# EAGLE design arduinoShield (EAGLE 9.2.2)
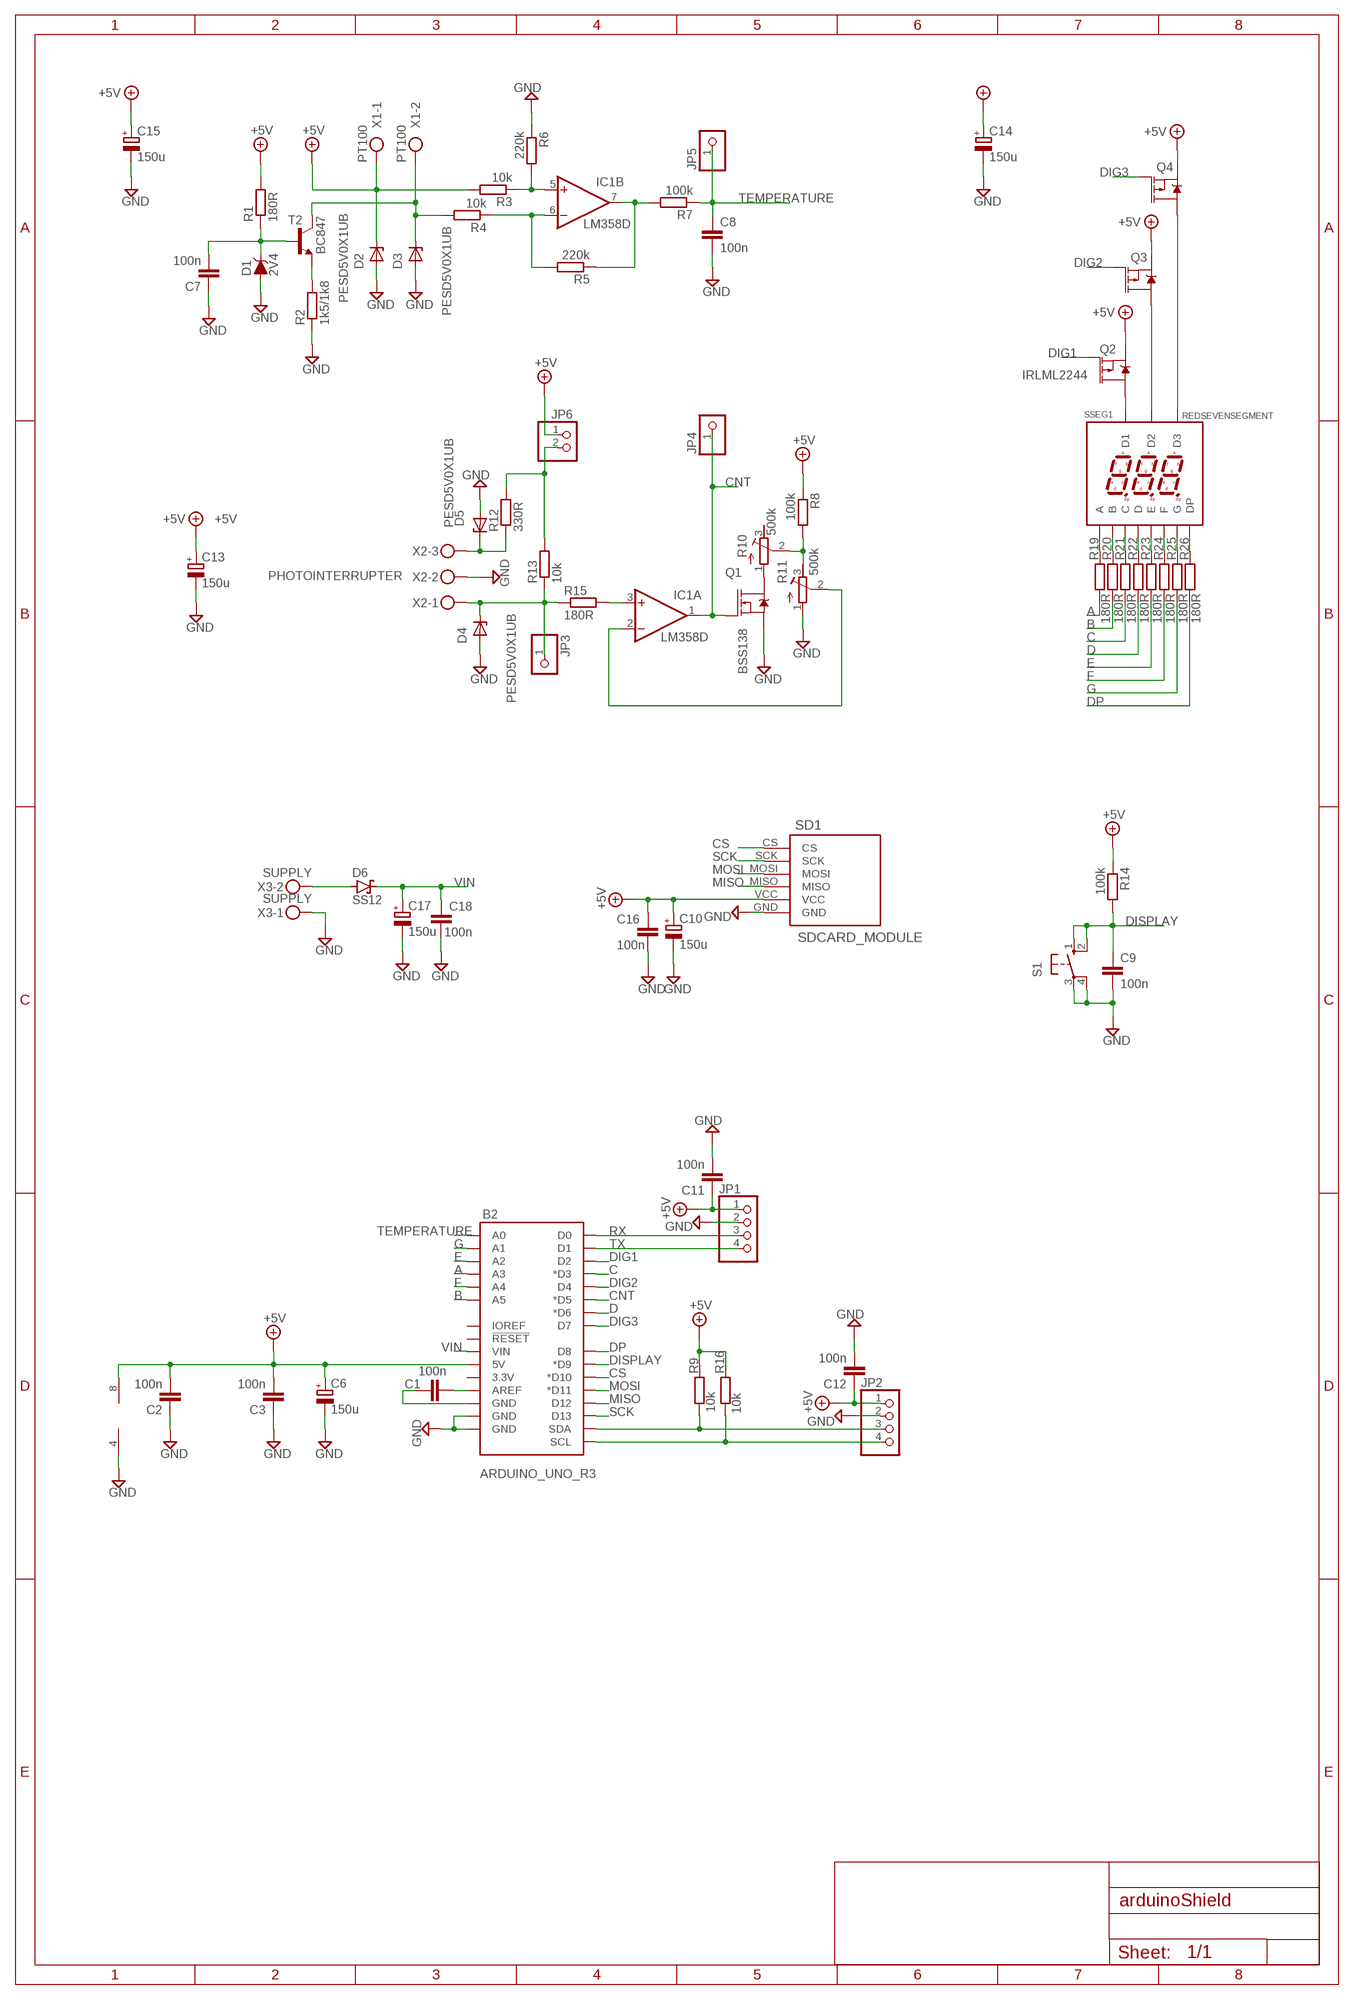
[diagram p0: schematic, sheet 1]

## Parts
B2  ARDUINO_UNO_R3  ARDUINO_UNO_R3_HOLES_NOISP  [ARDUINO_R3_NOISP]
C1  100n  C-EUC0805  [C0805]
C2  100n  C-EUC0805  [C0805]
C3  100n  C-EUC0805  [C0805]
C6  150u  CPOL-EUD/7343-31R  [D/7343-31R]
C7  100n  C-EUC0805  [C0805]
C8  100n  C-EUC0805  [C0805]
C9  100n  C-EUC0805  [C0805]
C10  150u  CPOL-EUD/7343-31R  [D/7343-31R]
C11  100n  C-EUC0805  [C0805]
C12  100n  C-EUC0805  [C0805]
C13  150u  CPOL-EUD/7343-31R  [D/7343-31R]
C14  150u  CPOL-EUD/7343-31R  [D/7343-31R]
C15  150u  CPOL-EUD/7343-31R  [D/7343-31R]
C16  100n  C-EUC0805  [C0805]
C17  150u  CPOL-EUD/7343-31R  [D/7343-31R]
C18  100n  C-EUC0805  [C0805]
D1  2V4  DIODE-ZENER-BZT52C3V6S  [SOD-323]
D2  PESD5V0X1UB  [SOD523]
D3  PESD5V0X1UB  [SOD523]
D4  PESD5V0X1UB  [SOD523]
D5  PESD5V0X1UB  [SOD523]
D6  SS12  [SMA]
IC1  LM358D  [SO08]
JP1  PINHD-1X4  [1X04]
JP2  PINHD-1X4  [1X04]
JP3  PINHD-1X1  [1X01]
JP4  PINHD-1X1  [1X01]
JP5  PINHD-1X1  [1X01]
JP6  PINHD-1X2  [1X02]
Q1  BSS138  MOSFET-NCH-BSS138  [SOT23-3]
Q2  IRLML2244  MOSFET_PCH-IRLML2244  [SOT23-3]
Q3  4.3A/20V/54mΩ  MOSFET_PCH-IRLML2244  [SOT23-3]
Q4  4.3A/20V/54mΩ  MOSFET_PCH-IRLML2244  [SOT23-3]
R1  180R  R-EU_R0805  [R0805]
R2  1k5/1k8  R-EU_R0805  [R0805]
R3  10k  R-EU_R0805  [R0805]
R4  10k  R-EU_R0805  [R0805]
R5  220k  R-EU_R0805  [R0805]
R6  220k  R-EU_R0805  [R0805]
R7  100k  R-EU_R0805  [R0805]
R8  100k  R-EU_R0805  [R0805]
R9  10k  R-EU_R0805  [R0805]
R10  500k  R-TRIMM64Y  [RTRIM64Y]
R11  500k  R-TRIMM64Y  [RTRIM64Y]
R12  330R  R-EU_R0805  [R0805]
R13  10k  R-EU_R0805  [R0805]
R14  100k  R-EU_R0805  [R0805]
R15  180R  R-EU_R0805  [R0805]
R16  10k  R-EU_R0805  [R0805]
R19  180R  R-EU_R0805  [R0805]
R20  180R  R-EU_R0805  [R0805]
R21  180R  R-EU_R0805  [R0805]
R22  180R  R-EU_R0805  [R0805]
R23  180R  R-EU_R0805  [R0805]
R24  180R  R-EU_R0805  [R0805]
R25  180R  R-EU_R0805  [R0805]
R26  180R  R-EU_R0805  [R0805]
S1  10-XX  [B3F-10XX]
SD1  SDCARD_MODULE  [SD_MODULE]
SSEG1  REDSEVENSEGMENT  [REDSEVENSEGMENT]
T2  BC847  BC847-NPN-SOT23-BEC  [SOT23-BEC]
X1  PT100  PCB2_TERMINAL-BLOCK  [2_2.54MM]
X2  PHOTOINTERRUPTER  MKDSN1,5/3-5,08  [MKDSN1,5/3-5,08]
X3  SUPPLY  MKDSN1,5/2-5,08  [MKDSN1,5/2-5,08]

## Nets
+5V: B2.5V C2.2 C3.2 C6.+ C10.+ C11.1 C12.1 C13.+ C14.+ C15.+ C16.1 D2.1(K) IC1.8(P:V+) JP1.1 JP2.1 JP6.1 Q2.2(S) Q3.2(S) Q4.2(S) R1.2 R3.2 R8.1 R9.2 R14.1 R16.2 SD1.VCC X1.1
A: B2.A3 R19.1
B: B2.A5 R20.1
C: B2.D3(*D3) R21.1
CNT: B2.D5(*D5) IC1.1(A:OUT) JP4.1 Q1.1(G)
CS: B2.D10(*D10) SD1.CS
D: B2.D6(*D6) R22.1
DIG1: B2.D2 Q2.1(G)
DIG2: B2.D4 Q3.1(G)
DIG3: B2.D7 Q4.1(G)
DISPLAY: B2.D9(*D9) C9.1 R14.2 S1.1(S) S1.2(S1)
DP: B2.D8 R26.1
E: B2.A2 R23.1
F: B2.A4 R24.1
G: B2.A1 R25.1
GND: B2.GND@1(GND) B2.GND@2(GND) C2.1 C3.1 C6.- C7.1 C8.2 C9.2 C10.- C11.2 C12.2 C13.- C14.- C15.- C16.2 C17.- C18.1 D1.A D2.2(A) D3.2(A) D4.2(A) D5.2(A) IC1.4(P:V-) JP1.2 JP2.2 Q1.2(S) R2.1 R6.1 R11.1(A) S1.3(P) S1.4(P1) SD1.GND X2.2 X3.1
MISO: B2.D12 SD1.MISO
MOSI: B2.D11(*D11) SD1.MOSI
N$1: B2.AREF C1.2
N$2: C7.2 D1.C R1.1 T2.B
N$3: R2.2 T2.E
N$4: D3.1(K) R4.2 T2.C X1.2
N$5: IC1.5(B:+IN) R3.1 R6.2
N$6: IC1.6(B:-IN) R4.1 R5.2
N$7: IC1.7(B:OUT) R5.1 R7.2
N$8: D5.1(K) R12.1 X2.3
N$9: B2.SDA JP2.3 R9.1
N$10: Q1.3(D) R10.1(A)
N$11: R8.2 R10.2(S) R11.3(E)
N$12: IC1.2(A:-IN) R11.2(S)
N$13: D4.1(K) JP3.1 R13.1 R15.1 X2.1
N$14: B2.SCL JP2.4 R16.1
N$15: JP6.2 R12.2 R13.2
N$16: B2.GND@3(GND) C1.1
N$18: Q2.3(D) SSEG1.2(D1)
N$19: Q3.3(D) SSEG1.4(D2)
N$20: Q4.3(D) SSEG1.5(D3)
N$21: D6.A X3.2
N$24: R19.2 SSEG1.9(A)
N$25: R20.2 SSEG1.7(B)
N$26: R21.2 SSEG1.1(C)
N$27: R22.2 SSEG1.3(D)
N$28: R23.2 SSEG1.10(E)
N$29: R24.2 SSEG1.8(F)
N$30: R25.2 SSEG1.11(G)
N$31: R26.2 SSEG1.6(DP)
N$32: IC1.3(A:+IN) R15.2
RX: B2.D0 JP1.3
SCK: B2.D13 SD1.SCK
TEMPERATURE: B2.A0 C8.1 JP5.1 R7.1
TX: B2.D1 JP1.4
VIN: B2.VIN C17.+ C18.2 D6.C
Unconnected: B2.3.3V B2.IOREF B2.RESET@1(!RESET!) R10.3(E)

## Library data of the parts
B2 = SparkFun-Boards_edit:ARDUINO_UNO_R3_HOLES_NOISP
C1-C3 C7-C9 C11 C12 C16 C18 = rcl:C-EU: CAPACITOR, European symbol; SPICEPREFIX: C
C6 C10 C13-C15 C17 = rcl:CPOL-EU: POLARIZED CAPACITOR, European symbol; SPICEPREFIX: C
D1 = SparkFun-DiscreteSemi:DIODE-ZENER: Zener Diode A Zener diode allows current to flow from its anode to its cathode like a normal semiconductor diode, but it also permits current to flow in the reverse direction when its "Zener voltage" is reached. - WIkipedia; PROD_ID: DIO-08199; VALUE: 3.6V
D2-D5 = nxp_60:PESD5V0X1UB: Ultra low capacitance unidirectional ElectroStatic Discharge (ESD) protection diode in a SOD523 (SC-79) ultra small and flat lead Surface-Mounted Device (SMD) plastic package designed to protect one signal line from the damage caused by ESD and other transients. AAL Eindhoven MK
D6 = Diodes:SS12: DIODE SCHOTTKY 20V 1A SMA Manufacturer's datasheet <https://www.onsemi.com/pub/Collateral/SS19-D.PDF>; CREATED_BY: PCBLayout.com; DIGIKEY_PART_NUMBER: SS12FSCT-ND; MANUFACTURER: ON Semiconductor; MPN: SS12; PACKAGE: SMA (DO-214AC)
IC1 = linear:LM358: OP AMP also LM158; LM258; LM2904 Source: http://cache.national.com/ds/LM/LM158.pdf
JP1 JP2 = pinhead:PINHD-1X4: PIN HEADER
JP3-JP5 = pinhead:PINHD-1X1: PIN HEADER
JP6 = pinhead:PINHD-1X2: PIN HEADER
Q1 = SparkFun-DiscreteSemi:MOSFET-NCH: N-channel MOSFETs Voltage controlled devices that allow control of high current outputs. SparkFun Products: SparkFun OpenScale <https://www.sparkfun.com/products/13261> SparkFun Digital Sandbox <https://www.sparkfun.com/products/12651> SparkFun Monster Moto Shield <https://www.sparkfun.com/products/10182> SparkFun MOSFET Power Controller <https://www.sparkfun.com/products/11214>; PROD_ID: TRANS-00830; VALUE: 220mA/50V/3.5Ω
Q2 = SparkFun-DiscreteSemi:MOSFET_PCH: P-channel MOSFETs Voltage controlled devices that allow control of high current outputs. SparkFun Products: SparkFun ESP32 Thing <https://www.sparkfun.com/products/13907> SparkFun ESP8266 Thing <https://www.sparkfun.com/products/13231>; PROD_ID: TRANS-11153; VALUE: 4.3A/20V/54mΩ
Q3 Q4 = SparkFun-DiscreteSemi:MOSFET_PCH: P-channel MOSFETs Voltage controlled devices that allow control of high current outputs. SparkFun Products: SparkFun ESP32 Thing <https://www.sparkfun.com/products/13907> SparkFun ESP8266 Thing <https://www.sparkfun.com/products/13231>; PROD_ID: TRANS-11153
R1-R9 R12-R16 R19-R26 = rcl:R-EU_: RESISTOR, European symbol; SPICEPREFIX: R
R10 R11 = rcl:R-TRIMM: Trimm resistor; SPICEMODEL: X; SPICEPREFIXL: POT
S1 = DC_LOAD_AU:10-XX: OMRON SWITCH; MPN: B3F-1000; OC_FARNELL: 176432; OC_NEWARK: 36M3542
SD1 = flightcontroller:SDCARD_MODULE: sd card module
SSEG1 = Neuhold_ssegment:REDSEVENSEGMENT: red 3 digit seven segment from neuhold electronic
T2 = DC_LOAD_AU:*-NPN-: NPN Transistror BF959 corrected 2008.03.06
X1 = nxs_con-misc:PCB2_TERMINAL-BLOCK: 2 way PCB terminal block 2.54mm RS Best.-Nr.: 790-1098
X2 = con-phoenix-508:MKDSN1,5/3-5,08: MKDSN 1,5/ 3-5,08 Printklemme Nennstrom: 13,5 A Nennspannung: 250 V Rastermaß: 5,08 mm Polzahl: 3 Anschlussart: Schraubanschluss Montage: Löten Anschlussrichtung Leiter/Platine: 0 ° Artikelnummer: 1729131 Source: http://eshop.phoenixcontact.com .. 1729131.pdf
X3 = con-phoenix-508:MKDSN1,5/2-5,08: MKDSN 1,5/ 2-5,08 Printklemme Nennstrom: 13,5 A Nennspannung: 250 V Rastermaß: 5,08 mm Polzahl: 2 Anschlussart: Schraubanschluss Montage: Löten Anschlussrichtung Leiter/Platine: 0 ° Artikelnummer: 1729128 Source: http://eshop.phoenixcontact.com .. 1729128.pdf

## Board
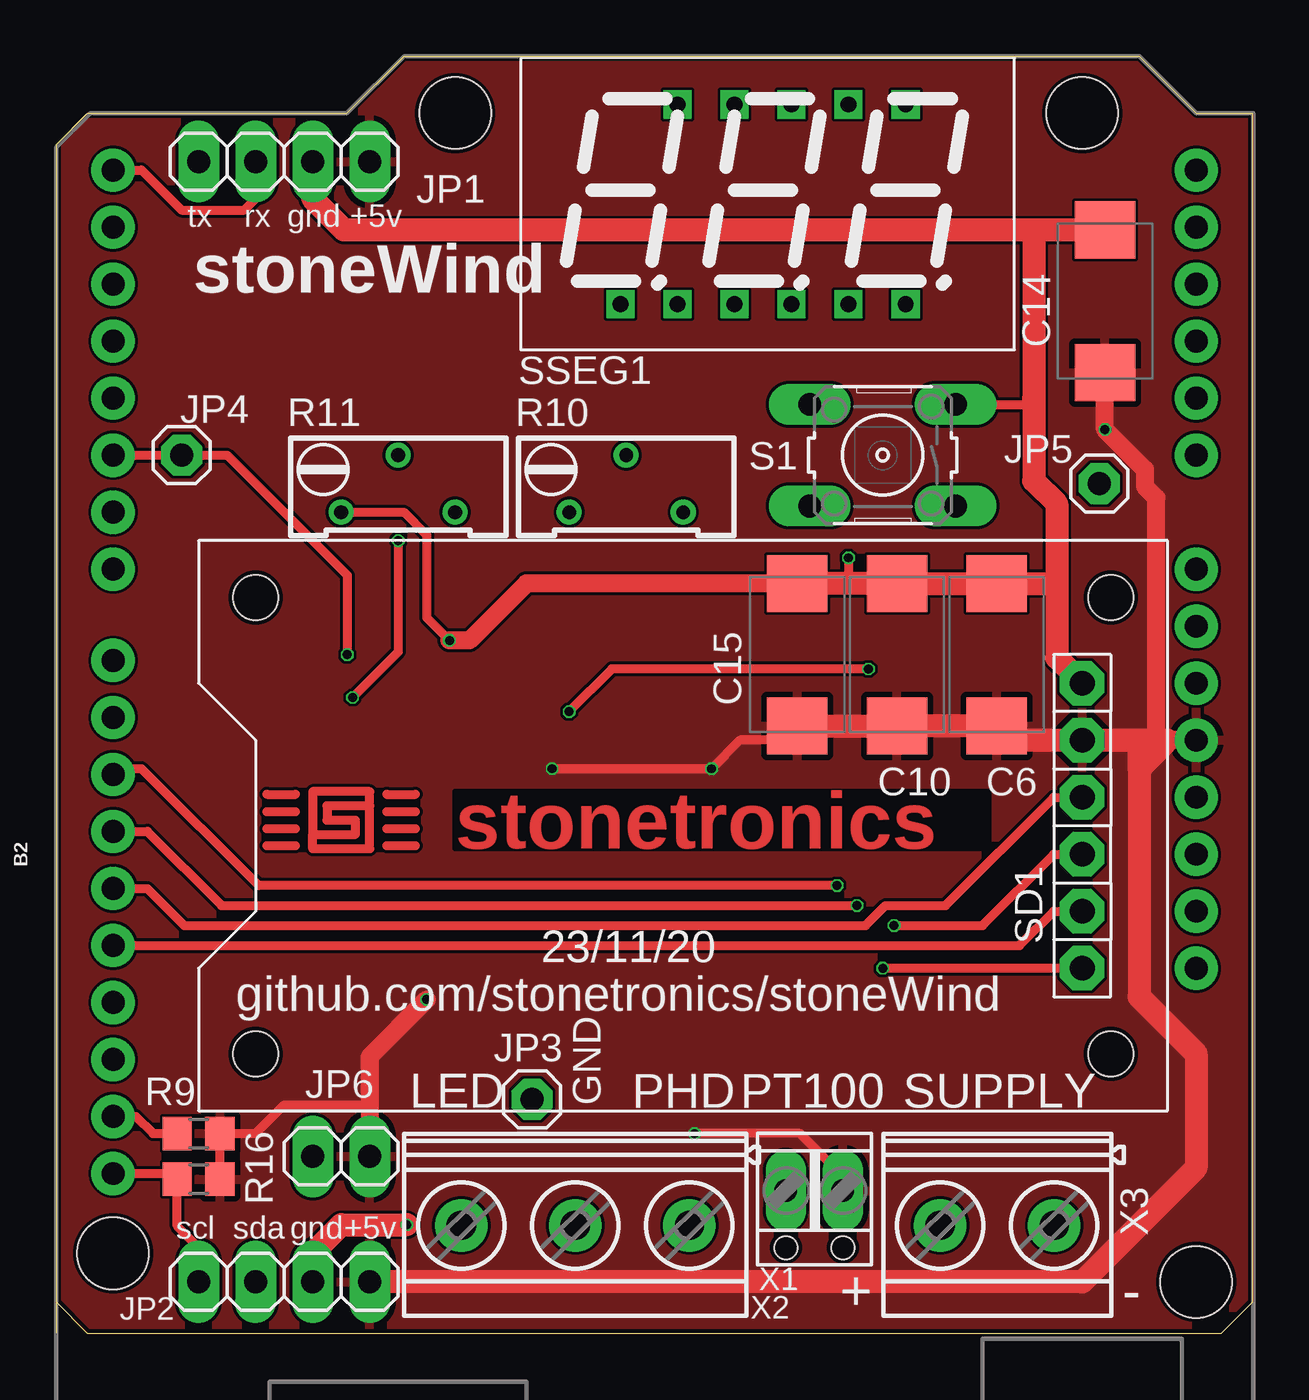
[diagram p1: board, top side]
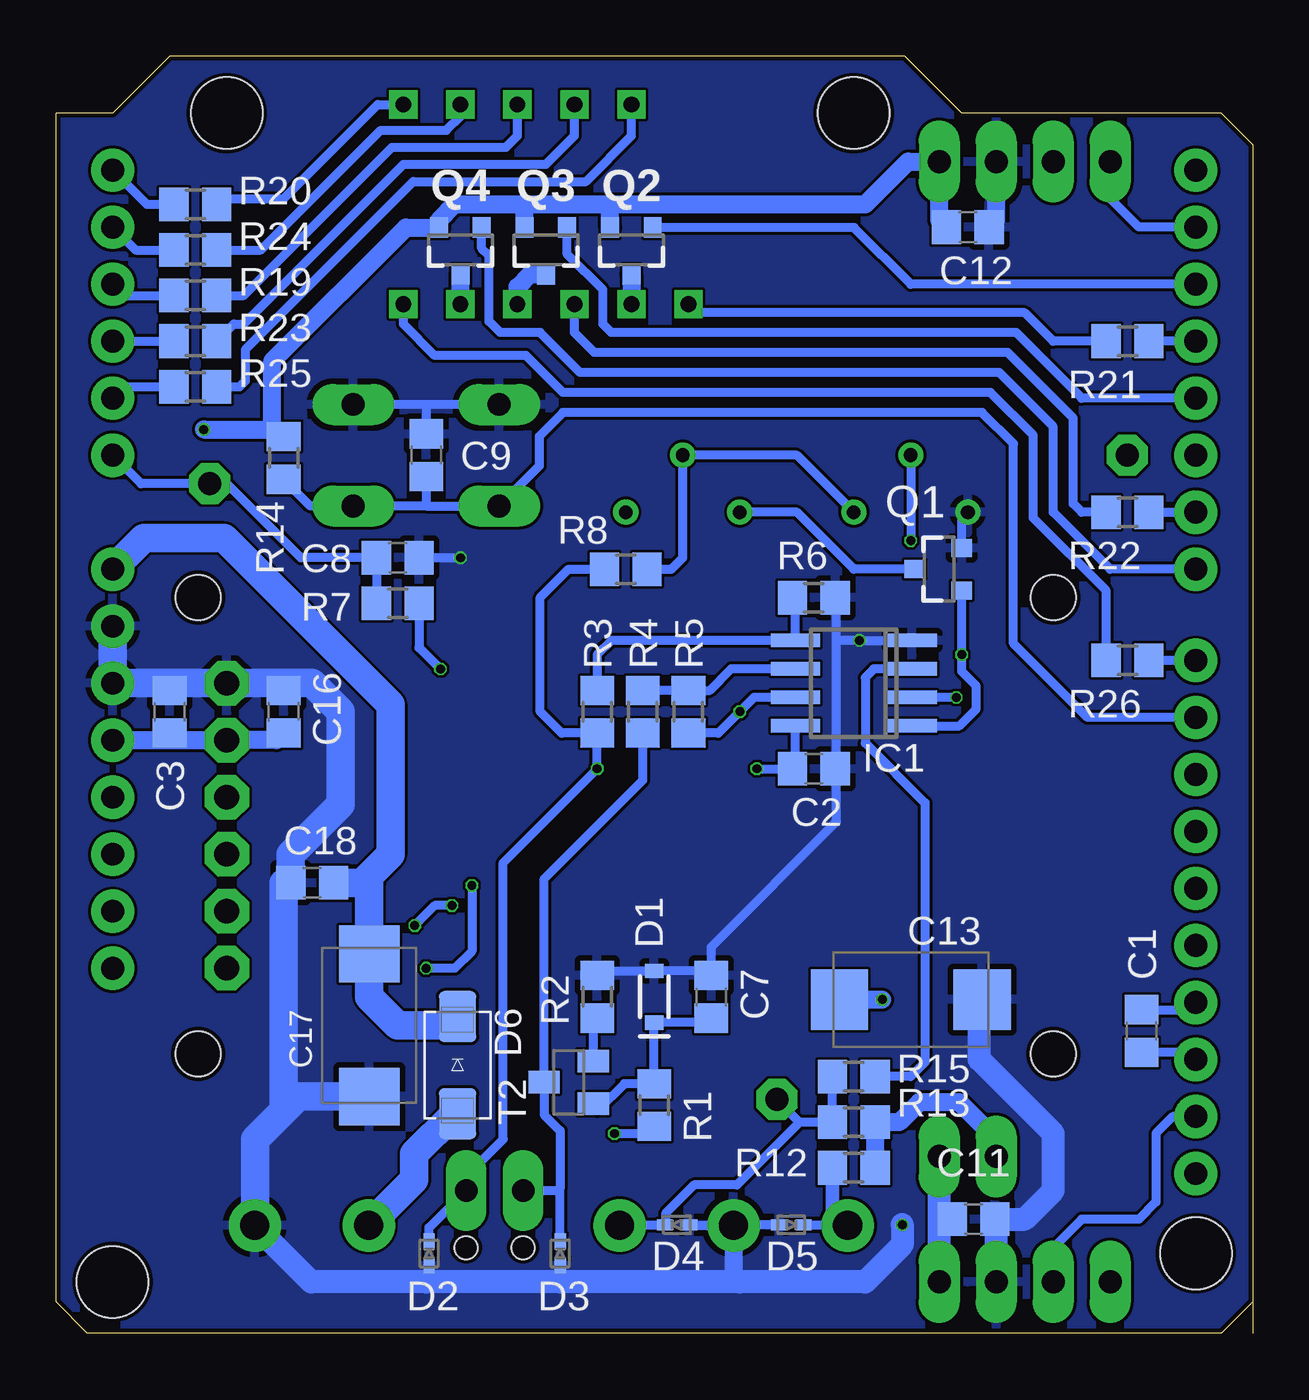
[diagram p2: board, bottom side, seen from below]

Size 53.32 x 56.9 mm. Coordinates in mm from the lower left corner, seen from the top.
Outline: 0,1.4 0,52.96 1.4,54.36 12.95,54.36 15.49,56.9 48.26,56.9 50.8,54.36 53.32,54.36 53.32,1.4 51.92,0 1.4,0 0,1.4
Outline: 0,1.4 0,0
Copper layers (1*16): Top 0.035mm / dielectric 1.6mm / Bottom 0.035mm
Design rules "jlcpcb-2layers": minimum track width 5mil, minimum drill 0.3mm, track to track 5mil, track to pad 5mil, pad to pad 5mil, via to via 5mil, smd to smd 5mil, copper to edge 0.2mm, drill to drill 6mil, minimum pad ring 10mil, minimum via ring 3mil, stop-mask expansion 4mil, vias tented up to drill 0mil, thermal gap 10mil

### Footprints (pad centres in the part's own frame; a part is rotated, then mirrored left to right if it is on the bottom)
ARDUINO_R3_NOISP = drill 1.016 pad 1.93: 3.3V 2.54,-24.13; 5V 5.08,-24.13; A0 17.78,-24.13; A1 20.32,-24.13; A2 22.86,-24.13; A3 25.4,-24.13; A4 27.94,-24.13; A5 30.48,-24.13; AREF -9.144,24.13; D0 30.48,24.13; D1 27.94,24.13; D2 25.4,24.13; D3 22.86,24.13; D4 20.32,24.13; D5 17.78,24.13; D6 15.24,24.13; D7 12.7,24.13; D8 8.636,24.13; D9 6.096,24.13; D10 3.556,24.13; D11 1.016,24.13; D12 -1.524,24.13; D13 -4.064,24.13; GND@1 7.62,-24.13; GND@2 10.16,-24.13; GND@3 -6.604,24.13; IOREF -2.54,-24.13; NC -5.08,-24.13; RESET@1 0,-24.13; SCL -14.224,24.13; SDA -11.684,24.13; VIN 12.7,-24.13 | hole 3.175: -17.78,24.13; 33.02,8.89; 33.02,-19.05; -19.05,-24.13
C0805 = smd 1.3 x 1.5: 1 -0.95,0; 2 0.95,0
D/7343-31R = smd 2.55 x 2.7: + 3.175,0; - -3.175,0
SOD-323 = smd 0.63 x 0.83: A 1.15,0; C -1.15,0
SOD523 = smd 0.7 x 0.5: 1 0.55,0; 2 -0.55,0
SMA = smd 2.28 x 1.66: A 2.165,0; C -2.165,0
SO08 = smd 0.6 x 2.2: 1 -1.905,-2.6; 2 -0.635,-2.6; 3 0.635,-2.6; 4 1.905,-2.6; 5 1.905,2.6; 6 0.635,2.6; 7 -0.635,2.6; 8 -1.905,2.6
1X04 = drill 1.016 long: 1 -3.81,0; 2 -1.27,0; 3 1.27,0; 4 3.81,0
1X01 = drill 1.016 octagon: 1 0,0
1X02 = drill 1.016 long: 1 -1.27,0; 2 1.27,0
SOT23-3 = smd 0.8 x 0.9: 1 -0.95,-1; 2 0.95,-1; 3 0,1.1
R0805 = smd 1.3 x 1.5: 1 -0.95,0; 2 0.95,0
RTRIM64Y = drill 0.61: 1 0,-2.54; 2 -2.54,0; 3 0,2.54
B3F-10XX = drill 1.016 long: 1 -3.251,2.261; 2 3.251,2.261; 3 -3.251,-2.261; 4 3.251,-2.261
SD_MODULE = drill 1.1 octagon: CS 0,6.35; GND 0,-6.35; MISO 0,-1.27; MOSI 0,1.27; SCK 0,3.81; VCC 0,-3.81 | hole 2: -1.27,-10.16; -1.27,10.16; 36.83,10.16; 36.83,-10.16
REDSEVENSEGMENT = drill 0.7 square: 1 -6.35,-3.81; 2 -3.81,-3.81; 3 -1.27,-3.81; 4 1.27,-3.81; 5 3.81,-3.81; 6 6.35,-3.81; 7 6.35,5.08; 8 3.81,5.08; 9 1.27,5.08; 10 -1.27,5.08; 11 -3.81,5.08
SOT23-BEC = smd 1 x 1.4: B -0.95,-1.1; C 0,1.1; E 0.95,-1.1
2_2.54MM = drill 1 long: 1 -1.27,0; 2 1.27,0 | hole 1.016: 1.27,2.54; -1.27,2.54
MKDSN1,5/3-5,08 = drill 1.3 pad 2: 1 -7.641,0.025; 2 -2.561,0.025; 3 2.519,0.025
MKDSN1,5/2-5,08 = drill 1.3 pad 2: 1 -2.561,0.025; 2 2.519,0.025

### Placement (x,y rotation side)
B2  26.67,21.34 90 top
C1  4.95,13.46 270 bottom
C2  19.56,25.15 180 bottom
C3  48.26,27.69 270 bottom
C6  41.91,30.23 270 top
C7  24.13,14.99 270 bottom
C8  38.1,34.54 0 bottom
C9  36.83,39.12 90 bottom
C10  37.47,30.23 270 top
C11  12.45,5.08 0 bottom
C12  12.7,49.28 0 bottom
C13  15.24,14.86 180 bottom
C14  46.74,45.97 270 top
C15  33.02,30.23 270 top
C16  43.18,27.69 90 bottom
C17  39.37,13.72 90 bottom
C18  41.91,20.07 0 bottom
D1  26.67,14.99 90 bottom
D2  36.7,3.56 90 bottom
D3  30.86,3.56 90 bottom
D4  25.65,4.83 180 bottom
D5  20.57,4.83 0 bottom
D6  35.43,11.94 270 bottom
IC1  17.78,28.96 90 bottom
JP1  10.16,52.2 180 top
JP2  10.16,2.29 180 top
JP3  21.21,10.41 0 top
JP4  5.59,39.12 0 top
JP5  46.48,37.85 0 top
JP6  12.7,7.87 180 top
Q1  13.97,34.04 90 bottom
Q2  27.69,48.26 180 bottom
Q3  31.5,48.26 180 bottom
Q4  35.31,48.26 180 bottom
R1  26.67,10.16 270 bottom
R2  29.21,14.99 270 bottom
R3  29.21,27.69 270 bottom
R4  27.18,27.69 270 bottom
R5  25.15,27.69 90 bottom
R6  19.56,32.77 180 bottom
R7  38.1,32.51 0 bottom
R8  27.94,34.04 0 bottom
R9  6.35,8.89 0 top
R10  25.4,36.58 270 top
R11  15.24,36.58 270 top
R12  17.78,7.37 0 bottom
R13  17.78,9.4 0 bottom
R14  43.18,38.99 270 bottom
R15  17.78,11.43 0 bottom
R16  6.35,6.86 0 top
R19  47.12,46.23 0 bottom
R20  47.12,50.29 0 bottom
R21  5.59,44.2 180 bottom
R22  5.59,36.58 180 bottom
R23  47.12,44.2 0 bottom
R24  47.12,48.26 0 bottom
R25  47.12,42.16 0 bottom
R26  5.59,29.97 180 bottom
S1  36.83,39.12 180 top
SD1  45.72,22.61 180 top
SSEG1  31.5,49.66 0 top
T2  30.48,11.18 90 bottom
X1  33.78,6.35 180 top
X2  20.57,4.83 180 top
X3  41.91,4.83 180 top

### Tracks (layer width: path | path; a pad name or v marks a point on that pad's centre or on a via)
+5V  (via drill 0.4)
  Top 0.406: X1.1 35.05,6.99 33.15,8.89 v28.45,8.89 | C15.+ 32.38,26.42 30.48,26.42 v29.21,25.15 v22.1,25.15 | C6.+ 42.55,26.42 | R16.2 R9.2 8.89,8.89 10.16,10.16 13.97,10.16
  Top 0.813: B2.5V 49.53,26.42 | 49.28,26.16 49.02,26.42 49.02,37.21 48.51,37.72 48.51,38.48 v46.74,40.26 C14.+ | v16.51,14.86 13.97,12.32 13.97,10.16 JP6.1
  Top 1.016: 48.26,25.15 49.28,26.16 49.53,26.42 48.26,26.42 | JP2.1 45.72,2.29 50.8,7.37 50.8,12.45 48.26,14.99 48.26,25.15 | 42.55,26.42 SD1.VCC 48.26,26.42 | 48.26,25.15 48.26,26.42 | C6.+ C10.+ C15.+
  Bottom 0.406: D2.1 36.7,4.7 X1.1 35.05,6.99 33.4,8.64 33.4,20.95 v29.21,25.15 R3.2 30.8,26.74 31.75,27.69 31.75,32.77 30.48,34.04 R8.1 | v28.45,8.89 26.99,8.89 R1.2 | IC1.8 20.38,25.27 C2.2 v22.1,25.15
  Bottom 0.813: B2.5V 48.26,26.42 | 48.26,26.42 SD1.VCC 43.5,26.42 C16.1 | 32.38,50.29 35.56,50.29 36.26,49.6 Q4.2 37.73,49.26 43.69,43.31 43.69,40.45 | 32.38,50.29 28.57,50.29 | 28.57,50.29 17.27,50.29 15.37,52.2 JP1.1 13.97,49.6 C12.1 | Q3.2 32.45,50.23 32.38,50.29 | Q2.2 28.64,50.23 28.57,50.29 | C13.+ v16.51,14.86 | R14.1 43.69,40.45 | v46.74,40.26 43.88,40.26 43.69,40.45 | C3.2 48.26,26.42
  Bottom 1.016: JP2.1 13.97,5.08 | 13.97,5.08 JP6.1 | C11.1 13.97,5.08
  pour Top: -2.54,62.23 55.88,62.23 55.88,-3.81 -2.54,-3.81
A
  Bottom 0.406: B2.A3 50.29,46.23 R19.1
B
  Bottom 0.406: B2.A5 49.28,50.29 R20.1
C
  Bottom 0.406: B2.D3 R21.1
CNT  (via drill 0.4)
  Top 0.406: v12.97,30.23 12.97,33.77 7.62,39.12 JP4.1 B2.D5
  Bottom 0.406: IC1.1 13.08,27.05 12.32,27.81 12.32,28.83 12.97,29.48 v12.97,30.23 Q1.1
CS  (via drill 0.4)
  Top 0.406: SD1.CS v36.83,16.26 | v34.8,19.94 9.02,19.94 3.81,25.15 2.79,25.15 B2.D10
  Bottom 0.406: v34.8,19.94 34.8,17.02 35.56,16.26 v36.83,16.26
D
  Bottom 0.406: R22.1 B2.D6
DIG1
  Bottom 0.406: Q2.1 17.76,49.26 15.24,46.74 B2.D2
DIG2
  Bottom 0.406: B2.D4 7.62,41.66 10.54,44.58 28.57,44.58 28.96,44.96 28.96,46.48 30.55,48.07 Q3.1
DIG3
  Bottom 0.406: B2.D7 6.35,34.04 8.89,36.58 8.89,40.39 11.3,42.8 29.97,42.8 31.75,44.58 33.53,44.58 34.04,45.09 34.04,48.01 34.36,48.33 Q4.1
DISPLAY
  Bottom 0.406: B2.D9 7.37,27.43 10.67,30.73 10.67,39.62 12.06,41.02 30.73,41.02 31.8,39.95 31.8,38.63 S1.2 36.83,36.85 | C9.1 36.83,36.85 | R14.2 42,36.85 S1.1 36.83,36.85
DP
  Bottom 0.406: B2.D8 R26.1
E
  Bottom 0.406: B2.A2 R23.1
F
  Bottom 0.406: B2.A4 49.78,48.26 R24.1
G
  Bottom 0.406: B2.A1 50.29,42.16 R25.1
GND  (via drill 0.4)
  Top 0.406: v35.31,34.54 35.31,33.4 | v17.53,30.86 16.51,31.88 16.51,35.56 15.49,36.58 R11.1 | S1.3 43.28,41.38 43.56,41.66
  Top 0.813: C15.- 20.95,33.4 18.41,30.86 v17.53,30.86
  Top 1.016: JP2.2 11.43,3.56 12.7,4.83 v15.62,4.83 | SD1.GND 44.58,30.1 44.58,33.4 | 44.58,33.4 44.58,36.96 43.56,37.97 43.56,41.66 43.56,49.15 C14.- 12.83,49.15 11.43,50.55 JP1.2 | 44.58,33.4 C6.- C10.- 35.31,33.4 C15.-
  Bottom 0.406: 36.83,41.38 C9.2 | D3.2 30.86,2.29 | D4.2 25.08,4.8 X2.2 23.11,4.83 D5.2 | R2.1 29.01,16.14 D1.A 24.33,16.14 C7.1 24.13,17.21 18.54,22.79 18.54,25.21 | Q1.2 12.97,36.31 R11.1 | C8.2 v35.31,34.54 | C2.1 18.54,25.21 | IC1.4 v17.53,30.86 18.54,30.86 | R6.1 18.54,32.7 18.54,30.86 | 18.54,25.21 18.54,30.86 | D2.2 36.7,2.29 36.83,2.29 | C13.- 12.19,14.86 12.19,14.61 | S1.4 36.83,41.38 | 36.83,41.38 S1.3
  Bottom 0.813: X3.1 44.45,4.82 44.45,4.83 | C12.2 11.43,49.6 JP1.2 | X2.2 23.14,2.56 22.86,2.29 | C16.2 43.18,28.96 | C3.1 48.26,28.96
  Bottom 1.016: X3.1 41.96,2.29 36.83,2.29 30.86,2.29 22.86,2.29 17.27,2.29 15.62,3.94 v15.62,4.83 | JP2.2 11.43,5.01 C11.2 10.16,5.08 8.89,6.35 8.89,8.89 12.19,12.19 12.19,14.86
  Bottom 1.27: 43.18,9.91 43.18,20.07 C18.1 42.86,21.34 40.64,23.56 40.64,27.69 41.91,28.96 43.18,28.96 SD1.GND 48.26,28.96 B2.GND@1 B2.GND@2 | 43.18,9.91 44.45,8.64 44.45,4.83 | C17.- 42.55,10.54 43.18,9.91
  pour Bottom: -5.08,62.23 59.69,62.23 59.69,-6.35 -5.08,-6.35
MISO
  Top 0.406: SD1.MISO 44.45,23.88 39.62,19.05 36.96,19.05 36.07,18.16 5.71,18.16 4.06,19.81 B2.D12
MOSI  (via drill 0.4)
  Top 0.406: v37.34,18.16 41.27,18.16 44.45,21.34 SD1.MOSI | B2.D11 4.06,22.35 7.37,19.05 v35.69,19.05
  Bottom 0.406: v37.34,18.16 36.45,19.05 v35.69,19.05
N$1
  Bottom 0.406: B2.AREF 2.86,12.51 C1.2
N$2
  Bottom 0.406: C7.2 24.33,13.84 D1.C R1.1 28.01,11.11 29.21,9.91 29.38,10.08 T2.B
N$3
  Bottom 0.406: T2.E 29.38,13.87 R2.2
N$4
  Bottom 0.406: D3.1 30.86,6.48 | X1.2 30.99,6.35 30.86,6.48 | 30.86,6.48 30.86,9.02 31.58,9.74 T2.C 31.58,20.24 27.18,24.64 R4.2
N$5
  Bottom 0.406: R3.1 29.21,30.23 28.57,30.86 IC1.5 20.38,32.64 R6.2
N$6
  Bottom 0.406: IC1.6 23.24,29.59 24.2,28.64 R5.2 R4.1
N$7  (via drill 0.4)
  Top 0.406: v36.2,29.59 24.77,29.59 v22.86,27.69
  Bottom 0.406: R7.2 37.15,30.55 v36.2,29.59 | IC1.7 22.23,28.32 v22.86,27.69 23.81,26.74 R5.1
N$8
  Bottom 0.406: X2.3 20,4.8 D5.1
  Bottom 0.61: R12.1 18.73,5.48 X2.3
N$9
  Top 0.406: B2.SDA 3.56,9.65 4.32,8.89 R9.1
  Bottom 0.406: JP2.3 8.89,3.81 7.62,5.08 5.08,5.08 4.32,5.84 4.32,8.89 3.56,9.65 B2.SDA
N$10
  Bottom 0.406: Q1.3 17.78,34.04 20.32,36.58 R10.1
N$11
  Bottom 0.406: R11.3 20.32,39.12 R10.2 25.4,34.54 25.91,34.04 R8.2
N$12  (via drill 0.4)
  Top 0.406: v13.21,28.32 15.24,30.35 v15.24,35.31
  Bottom 0.406: v13.21,28.32 IC1.2 | R11.2 v15.24,35.31
N$13
  Bottom 0.406: X2.1 26.23,4.8 D4.1 26.16,4.87 26.16,5.33 24.89,6.6 22.99,6.6 20.19,9.4 | 20.19,9.4 R13.1 R15.1 | 20.19,9.4 JP3.1
N$14
  Top 0.406: B2.SCL 5.15,7.11 R16.1 5.4,4.76 6.35,3.81 JP2.4
N$15
  Bottom 0.813: R12.2 R13.2 15.75,9.4 14.86,10.29 13.08,10.29 11.43,8.64 JP6.2
N$16
  Bottom 0.406: C1.1 2.86,14.41 B2.GND@3
N$17
  Top 0.406: 13.97,23.5 13.97,21.59 11.43,21.59 11.43,22.23 | 13.97,23.5 13.97,24.13 11.43,24.13 11.43,22.23 | 13.97,23.5 12.06,23.5 12.06,22.86 13.34,22.86 13.34,22.23 11.43,22.23
N$18
  Bottom 0.813: Q2.3 SSEG1.2
N$19
  Bottom 0.813: Q3.3 32.22,47.16 32.77,46.61 SSEG1.4
N$20
  Bottom 0.813: SSEG1.5 Q4.3
N$21
  Bottom 1.27: D6.A 35.57,9.77 37.36,7.98 37.36,6.83 X3.2
N$22
  Top 0.406: 14.73,24 16,24
N$23
  Top 0.406: 14.73,23.24 16,23.24
N$24
  Bottom 0.406: R19.2 44.96,46.23 38.35,52.83 33.27,52.83 32.77,53.34 SSEG1.9
N$25
  Bottom 0.406: R20.2 45.91,50.55 43.18,50.55 38.99,54.74 SSEG1.7
N$26
  Bottom 0.406: R21.2 8.89,44.2 10.16,45.47 24.77,45.47 SSEG1.1
N$27
  Bottom 0.406: R22.2 7.62,36.58 8,36.96 8,40.77 10.92,43.69 29.34,43.69 30.23,44.58 SSEG1.3
N$28
  Bottom 0.406: R23.2 45.41,44.96 44.96,44.96 37.85,52.07 31.5,52.07 30.23,53.34 SSEG1.10
N$29
  Bottom 0.406: R24.2 44.2,48.26 38.86,53.59 35.94,53.59 35.31,54.23 SSEG1.8
N$30
  Bottom 0.406: R25.2 45.15,42.16 44.9,42.42 44.9,43.81 37.4,51.31 29.72,51.31 27.69,53.34 SSEG1.11
N$31
  Bottom 0.406: SSEG1.6 37.85,44.96 36.45,43.56 32.38,43.56 30.73,41.91 11.68,41.91 9.78,40.01 9.78,36.32 6.54,33.08 R26.2
N$32
  Bottom 0.406: IC1.3 16.89,29.59 17.27,29.21 17.27,26.29 14.61,23.62 14.61,12.06 15.24,11.43 R15.2
N$33
  Top 0.406: 14.73,22.48 16,22.48
N$34
  Top 0.406: 14.73,21.72 16,21.72
N$35
  Top 0.406: 9.4,24 10.67,24
N$36
  Top 0.406: 9.4,23.24 10.67,23.24
N$37
  Top 0.406: 9.4,22.48 10.67,22.48
N$38
  Top 0.406: 9.4,21.72 10.67,21.72
RX
  Top 0.406: B2.D0 3.81,51.82 5.59,50.04 8.38,50.04 8.89,50.55 JP1.3
SCK
  Top 0.406: B2.D13 42.93,17.27 44.45,18.8 SD1.SCK
TEMPERATURE
  Bottom 0.406: R7.1 C8.1 42.42,34.54 45.72,37.85 JP5.1 49.53,37.85 B2.A0
TX
  Bottom 0.406: B2.D1 5.08,49.28 6.35,50.55 JP1.4
VIN
  Bottom 1.27: D6.C 35.82,13.72 38.1,13.72 39.37,14.99 C17.+ 39.37,20.07 C18.2 39.69,20.07 38.42,21.34 38.42,28.01 45.83,35.42 49.42,35.42 B2.VIN

### Text on the board
Top: stonetronics
tNames: tx | rx | gnd | +5v | stoneWind | 23/11/20 | github.com/stonetronics/stoneWind | LED | GND | PHD | PT100 | SUPPLY | scl | sda | gnd | +5v | + | -